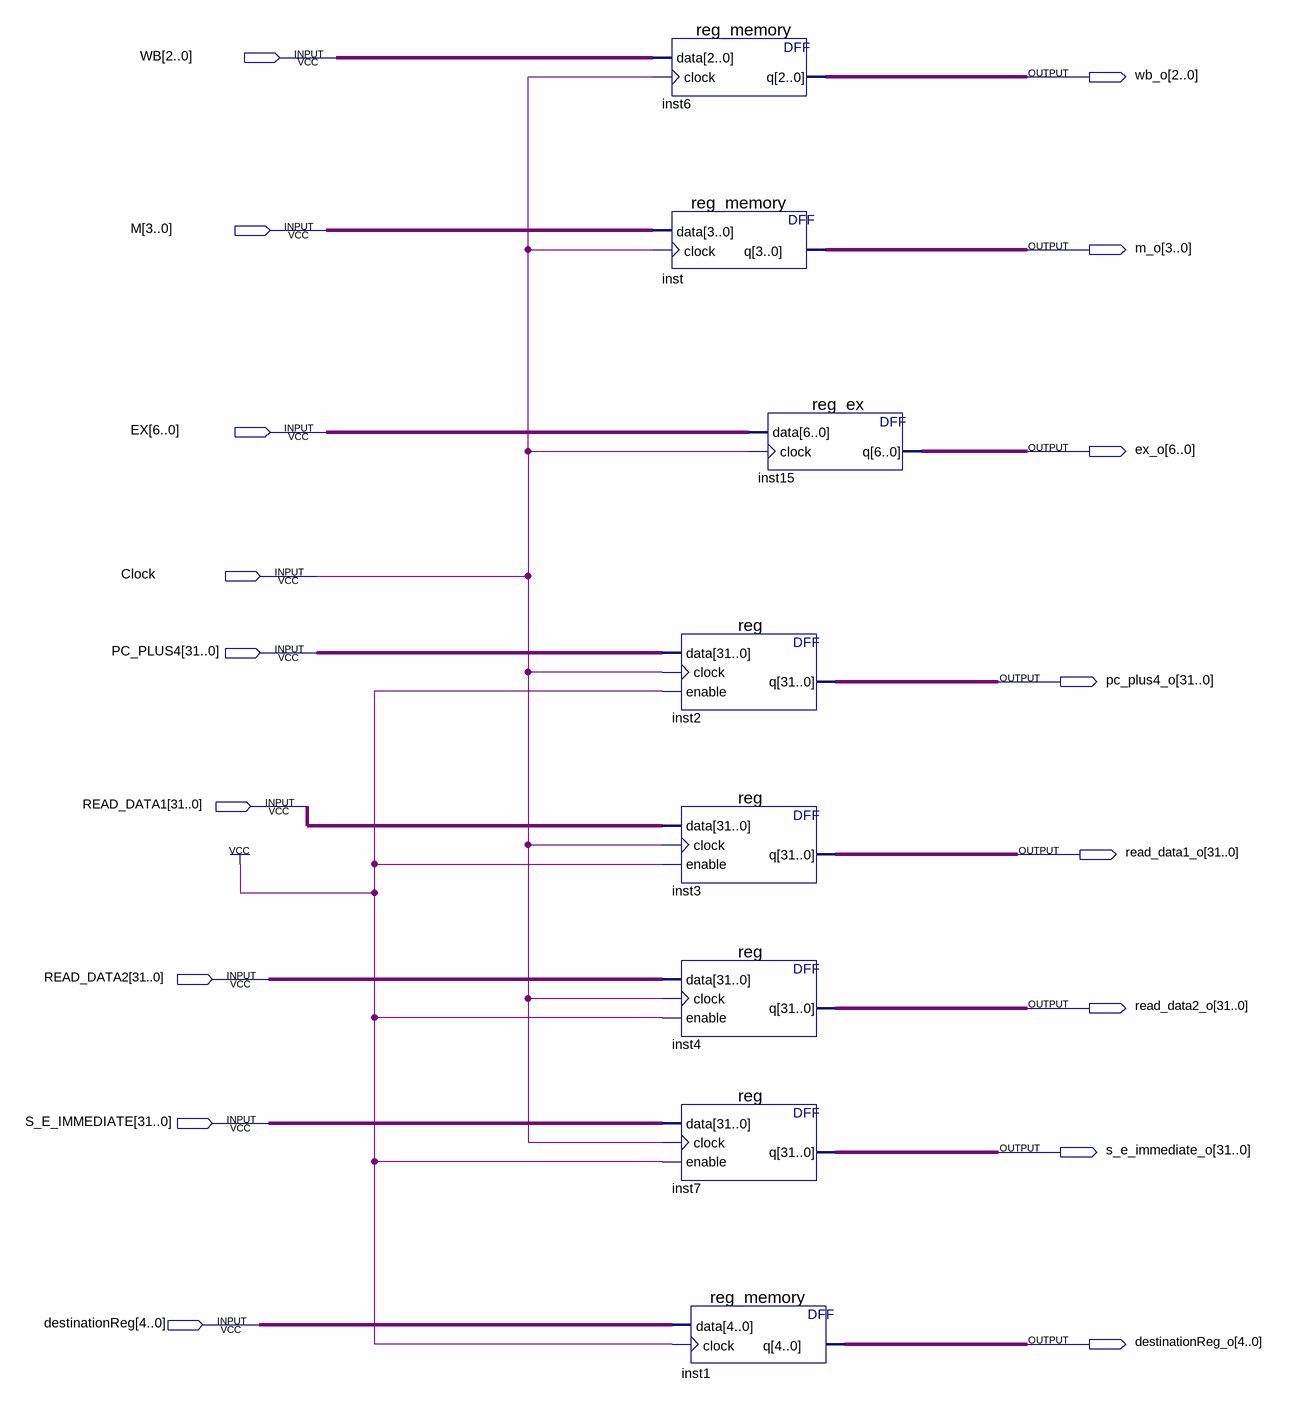
[diagram p0: schematic sheet]
// Quartus schematic IDEX.bdf as structural Verilog: 8 symbols, 17 pins
module IDEX (
  input  [2:0] WB,
  input  [3:0] M,
  input  [6:0] EX,
  input  Clock,
  input  [31:0] PC_PLUS4,
  input  [31:0] READ_DATA1,
  input  [31:0] READ_DATA2,
  input  [31:0] S_E_IMMEDIATE,
  input  [4:0] destinationReg,
  output [2:0] wb_o,
  output [3:0] m_o,
  output [6:0] ex_o,
  output [31:0] pc_plus4_o,
  output [31:0] read_data1_o,
  output [31:0] read_data2_o,
  output [31:0] s_e_immediate_o,
  output [4:0] destinationReg_o
);

  reg_memory inst6 (.data(WB), .clock(Clock), .q(wb_o));
  reg_memory inst (.data(M), .clock(Clock), .q(m_o));
  \reg  inst2 (.data(PC_PLUS4), .clock(Clock), .enable(1'b1), .q(pc_plus4_o));
  \reg  inst3 (.data(READ_DATA1), .clock(Clock), .enable(1'b1), .q(read_data1_o));
  \reg  inst4 (.data(READ_DATA2), .clock(Clock), .enable(1'b1), .q(read_data2_o));
  \reg  inst7 (.data(S_E_IMMEDIATE), .clock(Clock), .enable(1'b1), .q(s_e_immediate_o));
  reg_memory inst1 (.data(destinationReg), .clock(1'b1), .q(destinationReg_o));
  reg_ex inst15 (.data(EX), .clock(Clock), .q(ex_o));
endmodule
